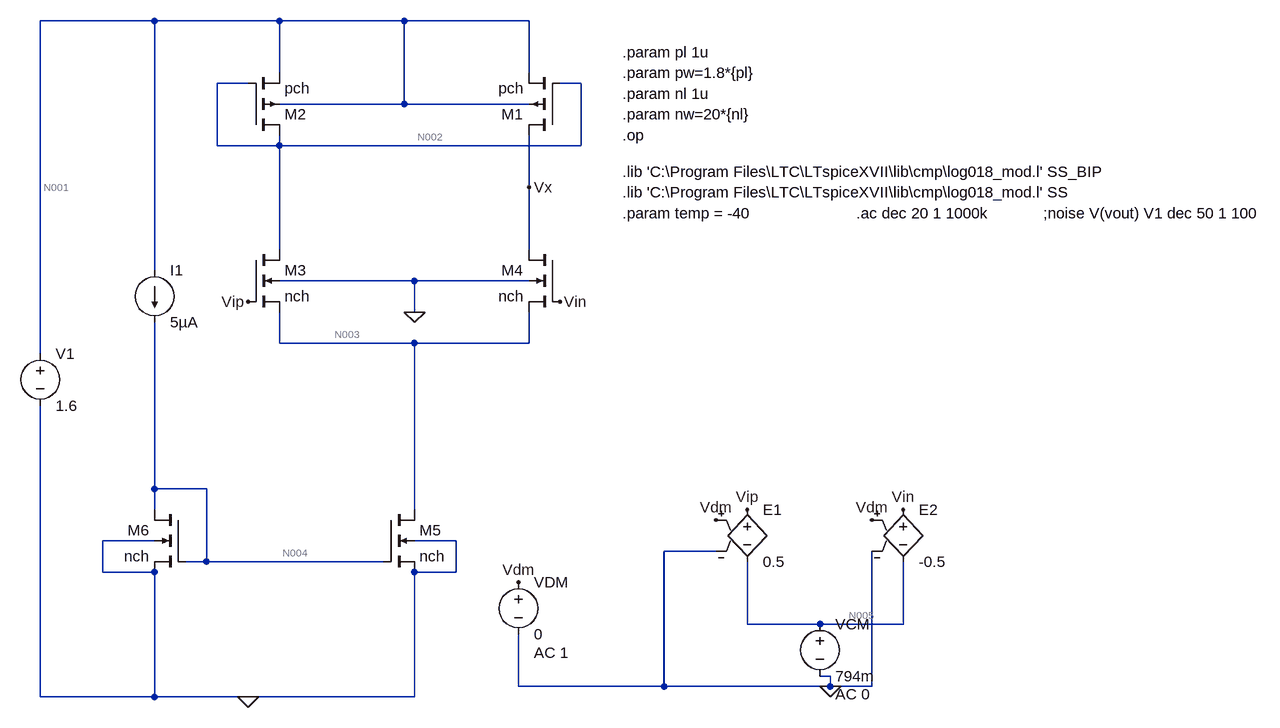
[diagram p0: schematic amplifier_chopper.asc]
amplifier_chopper.asc, the LTspice schematic file:
Version 4
SHEET 1 1880 836
WIRE -144 -224 -320 -224
WIRE 48 -224 -144 -224
WIRE 240 -224 48 -224
WIRE 432 -224 240 -224
WIRE 48 -144 48 -224
WIRE 432 -144 432 -224
WIRE 0 -128 -48 -128
WIRE 512 -128 480 -128
WIRE 240 -96 240 -224
WIRE 240 -96 48 -96
WIRE 432 -96 240 -96
WIRE -48 -32 -48 -128
WIRE 48 -32 48 -48
WIRE 48 -32 -48 -32
WIRE 512 -32 512 -128
WIRE 512 -32 48 -32
WIRE 432 32 432 -48
WIRE 48 128 48 -32
WIRE 432 128 432 32
WIRE -144 160 -144 -224
WIRE 256 176 48 176
WIRE 432 176 256 176
WIRE 256 224 256 176
WIRE 48 272 48 224
WIRE 256 272 48 272
WIRE 432 272 432 224
WIRE 432 272 256 272
WIRE -320 288 -320 -224
WIRE -144 496 -144 240
WIRE -64 496 -144 496
WIRE -144 528 -144 496
WIRE 256 528 256 272
WIRE -144 576 -224 576
WIRE 320 576 256 576
WIRE 720 592 640 592
WIRE -64 608 -64 496
WIRE -64 608 -96 608
WIRE 208 608 -64 608
WIRE -224 624 -224 576
WIRE -144 624 -224 624
WIRE 320 624 320 576
WIRE 320 624 256 624
WIRE 768 704 768 608
WIRE 880 704 768 704
WIRE 1008 704 1008 608
WIRE 1008 704 880 704
WIRE 896 784 880 784
WIRE 416 800 416 720
WIRE 640 800 640 592
WIRE 640 800 416 800
WIRE 896 800 896 784
WIRE 896 800 640 800
WIRE 960 800 960 592
WIRE 960 800 896 800
WIRE -320 816 -320 368
WIRE -144 816 -144 624
WIRE -144 816 -320 816
WIRE 0 816 -144 816
WIRE 256 816 256 624
WIRE 256 816 0 816
FLAG 256 224 0
FLAG 0 208 Vip
FLAG 480 208 Vin
FLAG 0 816 0
FLAG 896 800 0
FLAG 432 32 Vx
FLAG 768 528 Vip
FLAG 1008 528 Vin
FLAG 416 640 Vdm
FLAG 720 544 Vdm
FLAG 960 544 Vdm
SYMBOL nmos4 0 128 R0
SYMATTR InstName M3
SYMATTR Value2 l={nl} w={nw}
SYMATTR Value nch
SYMBOL nmos4 480 128 M0
SYMATTR InstName M4
SYMATTR Value2 l={nl} w={nw}
SYMATTR Value nch
SYMBOL nmos4 208 528 R0
SYMATTR InstName M5
SYMATTR Value2 l={nl} w={nw}
SYMATTR Value nch
SYMBOL nmos4 -96 528 M0
SYMATTR InstName M6
SYMATTR Value2 l={nl} w={nw}
SYMATTR Value nch
SYMBOL current -144 160 R0
WINDOW 123 0 0 Left 0
WINDOW 39 0 0 Left 0
SYMATTR InstName I1
SYMATTR Value 5µA
SYMBOL voltage -320 272 R0
WINDOW 123 0 0 Left 0
WINDOW 39 0 0 Left 0
SYMATTR InstName V1
SYMATTR Value 1.6
SYMBOL voltage 880 688 R0
WINDOW 123 24 124 Left 2
WINDOW 39 0 0 Left 0
SYMATTR Value2 AC 0
SYMATTR InstName VCM
SYMATTR Value 794m
SYMBOL e 768 512 R0
SYMATTR InstName E1
SYMATTR Value 0.5
SYMBOL e 1008 512 R0
SYMATTR InstName E2
SYMATTR Value -0.5
SYMBOL voltage 416 624 R0
WINDOW 123 24 124 Left 2
WINDOW 39 0 0 Left 0
SYMATTR Value2 AC 1
SYMATTR InstName VDM
SYMATTR Value 0
SYMBOL pmos4 480 -48 R180
SYMATTR InstName M1
SYMATTR Value2 l={pl} w={pw}
SYMATTR Value pch
SYMBOL pmos4 0 -48 M180
SYMATTR InstName M2
SYMATTR Value2 l={pl} w={pw}
SYMATTR Value pch
TEXT 576 72 Left 2 !.param temp = -40
TEXT 576 40 Left 2 !.lib 'C:\\Program Files\\LTC\\LTspiceXVII\\lib\\cmp\\log018_mod.l' SS
TEXT 576 8 Left 2 !.lib 'C:\\Program Files\\LTC\\LTspiceXVII\\lib\\cmp\\log018_mod.l' SS_BIP
TEXT 936 72 Left 2 !.ac dec 20 1 1000k
TEXT 1224 72 Left 2 !;noise V(vout) V1 dec 50 1 100
TEXT 576 -176 Left 2 !.param pl 1u
TEXT 576 -144 Left 2 !.param pw=1.8*{pl}
TEXT 576 -112 Left 2 !.param nl 1u
TEXT 576 -80 Left 2 !.param nw=20*{nl}
TEXT 576 -48 Left 2 !.op

The netlist it stands for:
* amplifier_chopper.asc
M3 N002 Vip N003 0 nch l={nl} w={nw}
M4 Vx Vin N003 0 nch l={nl} w={nw}
M5 N003 N004 0 0 nch l={nl} w={nw}
M6 N004 N004 0 0 nch l={nl} w={nw}
I1 N001 N004 5µA
V1 N001 0 1.6
VCM N005 0 794m AC 0
E1 Vip N005 Vdm 0 0.5
E2 Vin N005 Vdm 0 -0.5
VDM Vdm 0 0 AC 1
M1 Vx N002 N001 N001 pch l={pl} w={pw}
M2 N002 N002 N001 N001 pch l={pl} w={pw}
.model NMOS NMOS
.model PMOS PMOS
.lib standard.mos
.param temp = -40
.lib 'C:\Program Files\LTC\LTspiceXVII\lib\cmp\log018_mod.l' SS
.lib 'C:\Program Files\LTC\LTspiceXVII\lib\cmp\log018_mod.l' SS_BIP
.ac dec 20 1 1000k
;noise V(vout) V1 dec 50 1 100
.param pl 1u
.param pw=1.8*{pl}
.param nl 1u
.param nw=20*{nl}
.op
.backanno
.end

* Results of the author's LTspice run, read from the files saved beside the schematic
* Operating Point, zero values left out:
*   V(n002) = 869.8 mV
*   V(vip) = 794 mV
*   V(n003) = 235.6 mV
*   V(vx) = 869.8 mV
*   V(vin) = 794 mV
*   V(n004) = 528.3 mV
*   V(n001) = 1.6 V
*   V(n005) = 794 mV
*   Id(M2) = -2.427 µA
*   Is(M2) = 2.427 µA
*   Id(M1) = -2.427 µA
*   Is(M1) = 2.427 µA
*   Id(M6) = 5 µA
*   Is(M6) = -5 µA
*   Id(M5) = 4.854 µA
*   Is(M5) = -4.854 µA
*   Id(M4) = 2.427 µA
*   Ib(M4) = -1.127 pA
*   Is(M4) = -2.427 µA
*   Id(M3) = 2.427 µA
*   Ib(M3) = -1.127 pA
*   Is(M3) = -2.427 µA
*   I(I1) = 5 µA
*   I(V1) = -9.854 µA
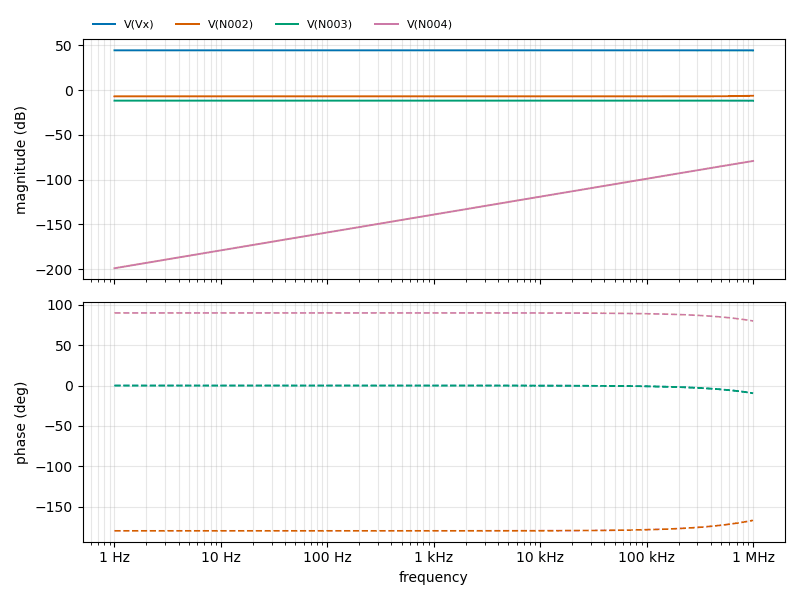
[diagram p1: AC Analysis of amplifier_chopper.asc, plotted from the saved traces]
* AC Analysis, 1 run:
*   V(Vx): 44.52 dB at 1 Hz, 44.41 dB at 1 MHz, peak 44.52 dB at 1 Hz
*   V(N002): -6.88 dB at 1 Hz, -6.29 dB at 1 MHz, peak -6.29 dB at 1 MHz
*   V(N003): -11.70 dB at 1 Hz, -11.82 dB at 1 MHz, peak -11.70 dB at 1 Hz
*   V(N004): -199.05 dB at 1 Hz, -79.16 dB at 1 MHz, peak -79.16 dB at 1 MHz, 3 dB below the peak at 702.6 kHz
* From the log:
*   Semiconductor Device Operating Points:
*                           --- BSIM3 MOSFETS ---
*   Name:        m2          m1          m6          m5          m4
*   Model:      pch.5       pch.5       nch.2       nch.2       nch.2
*   Id:       -2.43e-06   -2.43e-06    5.00e-06    4.85e-06    2.43e-06
*   Vgs:      -7.30e-01   -7.30e-01    5.28e-01    5.28e-01    5.58e-01
*   Vds:      -7.30e-01   -7.30e-01    5.28e-01    2.36e-01    6.34e-01
*   Vbs:       0.00e+00    0.00e+00    0.00e+00    0.00e+00   -2.36e-01
*   Vth:      -5.20e-01   -5.20e-01    5.81e-01    5.81e-01    6.45e-01
*   Vdsat:    -2.03e-01   -2.03e-01    6.62e-02    6.62e-02    5.91e-02
*   Gm:        1.96e-05    1.96e-05    1.02e-04    9.88e-05    5.26e-05
*   Gds:       1.05e-07    1.05e-07    4.17e-07    7.08e-07    2.07e-07
*   Gmb        6.52e-06    6.52e-06    2.97e-05    2.89e-05    1.37e-05
*   Cbd:       0.00e+00    0.00e+00    0.00e+00    0.00e+00    0.00e+00
*   Cbs:       0.00e+00    0.00e+00    0.00e+00    0.00e+00    0.00e+00
*   Cgsov:     5.52e-16    5.52e-16    6.96e-15    6.96e-15    6.96e-15
*   Cgdov:     5.52e-16    5.52e-16    6.96e-15    6.96e-15    6.96e-15
*   Cgbov:     2.64e-16    2.64e-16    1.76e-16    1.76e-16    1.76e-16
*   dQgdVgb:   1.20e-14    1.20e-14    5.90e-14    5.90e-14    4.98e-14
*   dQgdVdb:  -5.53e-16   -5.53e-16   -6.96e-15   -6.97e-15   -6.96e-15
*   dQgdVsb:  -1.06e-14   -1.06e-14   -2.03e-14   -2.03e-14   -1.22e-14
*   dQddVgb:  -5.69e-16   -5.69e-16   -6.98e-15   -7.08e-15   -6.96e-15
*   dQddVdb:   5.59e-16    5.59e-16    6.96e-15    6.99e-15    6.96e-15
*   dQddVsb:   1.52e-17    1.52e-17    3.26e-17    1.30e-16    8.71e-18
*   dQbdVgb:  -1.98e-15   -1.98e-15   -3.09e-14   -3.09e-14   -3.04e-14
*   dQbdVdb:  -1.59e-18   -1.59e-18    3.41e-19   -4.30e-18    1.99e-19
*   dQbdVsb:  -1.82e-15   -1.82e-15   -5.01e-15   -5.01e-15   -1.62e-15
*   Name:        m3
*   Model:      nch.2
*   Id:        2.43e-06
*   Vgs:       5.58e-01
*   Vds:       6.34e-01
*   Vbs:      -2.36e-01
*   Vth:       6.45e-01
*   Vdsat:     5.91e-02
*   Gm:        5.26e-05
*   Gds:       2.07e-07
*   Gmb        1.37e-05
*   Cbd:       0.00e+00
*   Cbs:       0.00e+00
*   Cgsov:     6.96e-15
*   Cgdov:     6.96e-15
*   Cgbov:     1.76e-16
*   dQgdVgb:   4.98e-14
*   dQgdVdb:  -6.96e-15
*   dQgdVsb:  -1.22e-14
*   dQddVgb:  -6.96e-15
*   dQddVdb:   6.96e-15
*   dQddVsb:   8.71e-18
*   dQbdVgb:  -3.04e-14
*   dQbdVdb:   1.99e-19
*   dQbdVsb:  -1.62e-15